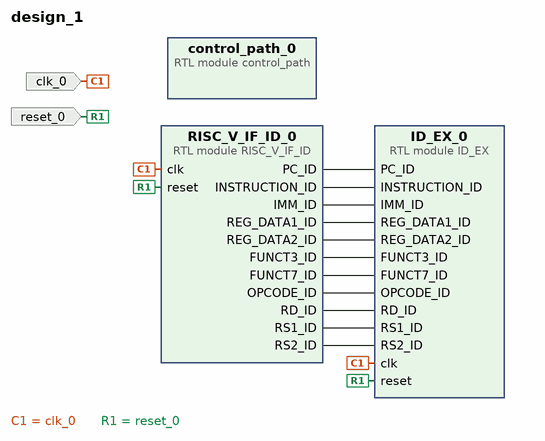
[diagram p0: block diagram of the top level]
# Vivado block design design_1, xc7a100tcsg324-1, Vivado 2019.2
create_bd_design design_1

create_bd_port -dir I -type clk clk_0
create_bd_port -dir I -type rst reset_0

create_bd_cell -type module -reference RISC_V_IF_ID RISC_V_IF_ID_0
create_bd_cell -type module -reference control_path control_path_0
create_bd_cell -type module -reference ID_EX ID_EX_0

# ---- connections ----

connect_bd_net -net clk_0_1 [get_bd_ports clk_0] [get_bd_pins RISC_V_IF_ID_0/clk] [get_bd_pins ID_EX_0/clk]
connect_bd_net -net reset_0_1 [get_bd_ports reset_0] [get_bd_pins RISC_V_IF_ID_0/reset] [get_bd_pins ID_EX_0/reset]
connect_bd_net [get_bd_pins RISC_V_IF_ID_0/PC_ID] [get_bd_pins ID_EX_0/PC_ID]
connect_bd_net [get_bd_pins RISC_V_IF_ID_0/INSTRUCTION_ID] [get_bd_pins ID_EX_0/INSTRUCTION_ID]
connect_bd_net [get_bd_pins RISC_V_IF_ID_0/IMM_ID] [get_bd_pins ID_EX_0/IMM_ID]
connect_bd_net [get_bd_pins RISC_V_IF_ID_0/REG_DATA1_ID] [get_bd_pins ID_EX_0/REG_DATA1_ID]
connect_bd_net [get_bd_pins RISC_V_IF_ID_0/REG_DATA2_ID] [get_bd_pins ID_EX_0/REG_DATA2_ID]
connect_bd_net [get_bd_pins RISC_V_IF_ID_0/FUNCT3_ID] [get_bd_pins ID_EX_0/FUNCT3_ID]
connect_bd_net [get_bd_pins RISC_V_IF_ID_0/FUNCT7_ID] [get_bd_pins ID_EX_0/FUNCT7_ID]
connect_bd_net [get_bd_pins RISC_V_IF_ID_0/OPCODE_ID] [get_bd_pins ID_EX_0/OPCODE_ID]
connect_bd_net [get_bd_pins RISC_V_IF_ID_0/RD_ID] [get_bd_pins ID_EX_0/RD_ID]
connect_bd_net [get_bd_pins RISC_V_IF_ID_0/RS1_ID] [get_bd_pins ID_EX_0/RS1_ID]
connect_bd_net [get_bd_pins RISC_V_IF_ID_0/RS2_ID] [get_bd_pins ID_EX_0/RS2_ID]

validate_bd_design
save_bd_design
